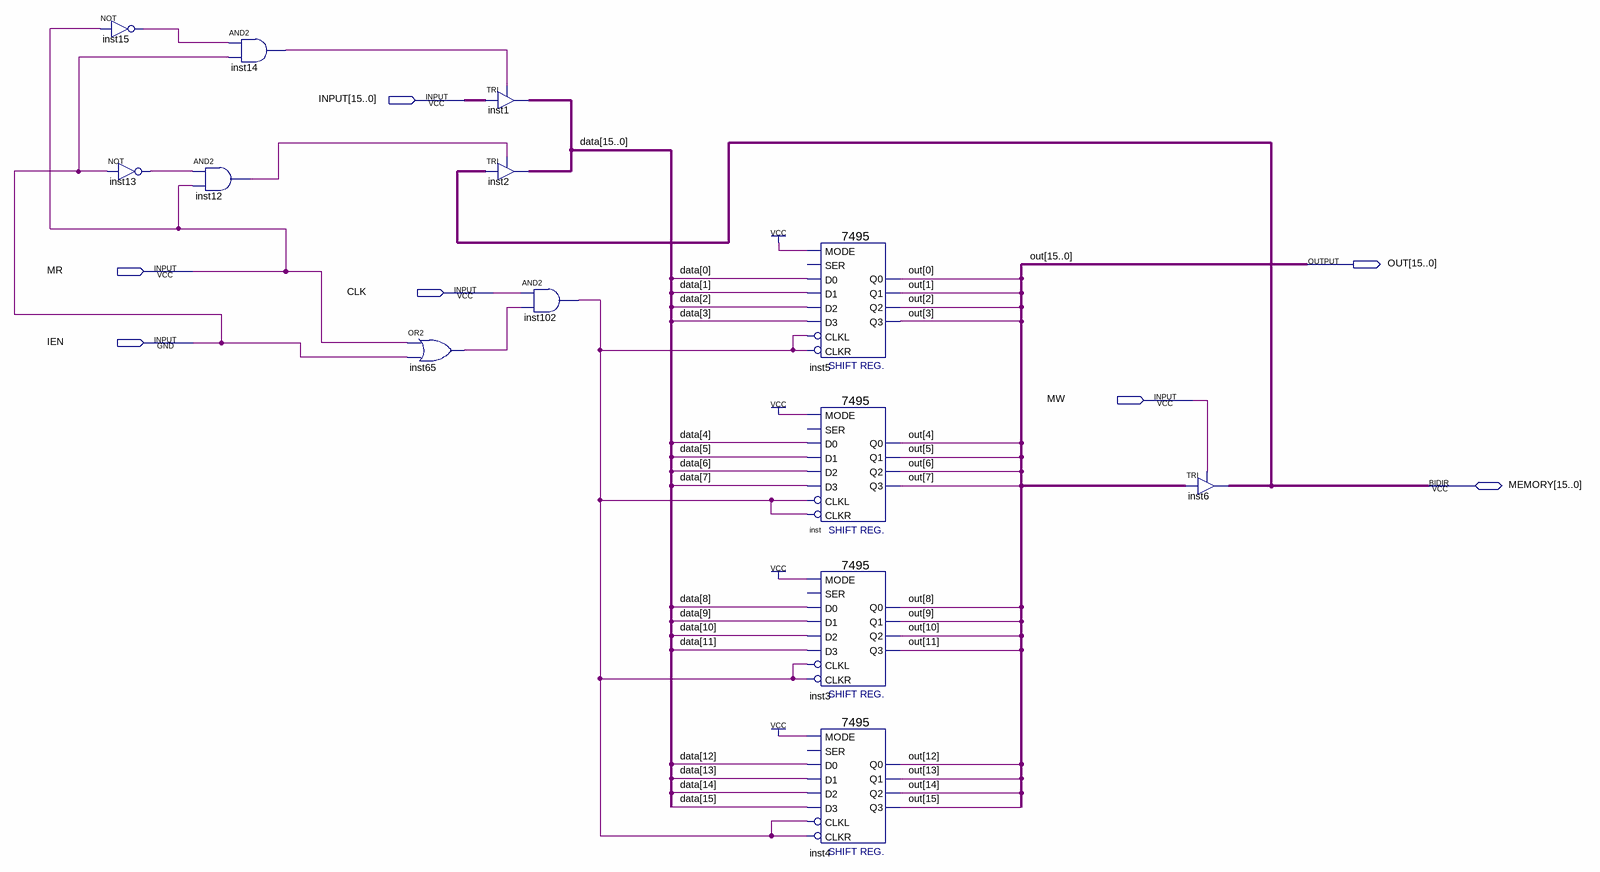
[diagram p0: schematic sheet]
// Quartus schematic reg_w.bdf as structural Verilog: 13 symbols, 7 pins
module reg_w (
  input  [15:0] INPUT,
  input  MR,
  input  CLK,
  input  IEN,
  input  MW,
  inout  [15:0] MEMORY,
  output [15:0] OUT
);

  wire inst12_out, inst13_out, inst14_out, inst15_out, inst65_out, inst102_out;
  wire [15:0] data;

  not inst15 (inst15_out, MR);
  not inst13 (inst13_out, IEN);
  and inst14 (inst14_out, inst15_out, IEN);
  and inst12 (inst12_out, inst13_out, MR);
  or inst65 (inst65_out, MR, IEN);
  TRI inst1[15:0] (.IN(INPUT), .OE(inst14_out), .OUT(data));
  TRI inst2[15:0] (.IN(MEMORY), .OE(inst12_out), .OUT(data));
  and inst102 (inst102_out, CLK, inst65_out);
  \7495  inst5 (
    .D1(data[1]), .D2(data[2]), .D0(data[0]), .D3(data[3]), .CLKL(inst102_out), .CLKR(inst102_out),
    .MODE(1'b1), .Q1(OUT[1]), .Q2(OUT[2]), .Q0(OUT[0]), .Q3(OUT[3]));  // open: SER
  \7495  inst (
    .D1(data[5]), .D2(data[6]), .D0(data[4]), .D3(data[7]), .CLKL(inst102_out), .CLKR(inst102_out),
    .MODE(1'b1), .Q1(OUT[5]), .Q2(OUT[6]), .Q0(OUT[4]), .Q3(OUT[7]));  // open: SER
  \7495  inst3 (
    .D1(data[9]), .D2(data[10]), .D0(data[8]), .D3(data[11]), .CLKL(inst102_out), .CLKR(inst102_out),
    .MODE(1'b1), .Q1(OUT[9]), .Q2(OUT[10]), .Q0(OUT[8]), .Q3(OUT[11]));  // open: SER
  \7495  inst4 (
    .D1(data[13]), .D2(data[14]), .D0(data[12]), .D3(data[15]), .CLKL(inst102_out), .CLKR(inst102_out),
    .MODE(1'b1), .Q1(OUT[13]), .Q2(OUT[14]), .Q0(OUT[12]), .Q3(OUT[15]));  // open: SER
  TRI inst6[15:0] (.IN(OUT), .OE(MW), .OUT(MEMORY));
endmodule
